# EAGLE design welder_pcb (EAGLE 8.5.2)
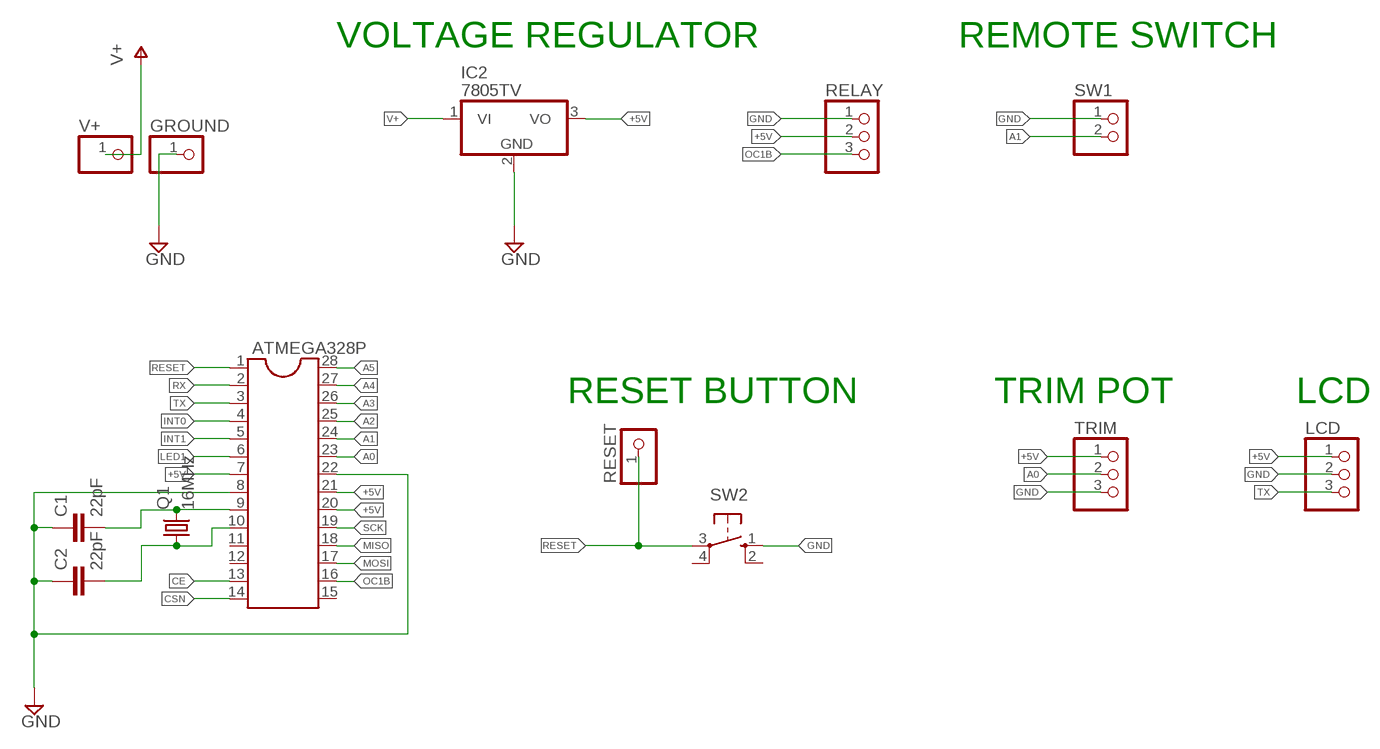
[diagram p0: schematic, sheet 1]

## Parts
ATMEGA328P  DIL28-3  [DIL28-3]
C1  22pF  C2,5-3  [C2.5-3]
C2  22pF  C2,5-3  [C2.5-3]
GROUND  PINHD-1X1  [1X01]
IC2  7805TV  [TO220V]
LCD  PINHD-1X3  [1X03]
Q1  16MHz  CRYSTALHC49U-V  [HC49U-V]
RELAY  PINHD-1X3  [1X03]
RESET  PINHD-1X1  [1X01]
SW1  PINHD-1X2  [1X02]
SW2  10-XX  [B3F-10XX]
TRIM  PINHD-1X3  [1X03]
V+  PINHD-1X1  [1X01]

## Nets
+5V: ATMEGA328P.7 ATMEGA328P.20 ATMEGA328P.21 IC2.3(VO) LCD.1 RELAY.2 TRIM.1
A0: ATMEGA328P.23 TRIM.2
A1: ATMEGA328P.24 SW1.2
A2: ATMEGA328P.25
A3: ATMEGA328P.26
A4: ATMEGA328P.27
A5: ATMEGA328P.28
CE: ATMEGA328P.13
CSN: ATMEGA328P.14
GND: ATMEGA328P.8 ATMEGA328P.22 C1.1 C2.1 GROUND.1 IC2.2(GND) LCD.2 RELAY.1 SW1.1 SW2.1(S) TRIM.3
INT0: ATMEGA328P.4
INT1: ATMEGA328P.5
LED1: ATMEGA328P.6
MISO: ATMEGA328P.18
MOSI: ATMEGA328P.17
N$1: ATMEGA328P.9 C1.2 Q1.2
N$2: ATMEGA328P.10 C2.2 Q1.1
OC1B: ATMEGA328P.16 RELAY.3
RESET: ATMEGA328P.1 RESET.1 SW2.3(P)
RX: ATMEGA328P.2
SCK: ATMEGA328P.19
TX: ATMEGA328P.3 LCD.3
V+: IC2.1(VI) V+.1
Unconnected: ATMEGA328P.11 ATMEGA328P.12 ATMEGA328P.15 SW2.2(S1) SW2.4(P1)

## Notes on the sheet
- VOLTAGE REGULATOR | REMOTE SWITCH
- RESET BUTTON | TRIM POT | LCD

## Library data of the parts
ATMEGA328P = ic-package:DIL28: Dual In Line
C1 C2 = capacitor-wima:C: CAPACITOR naming: grid - package width
GROUND RESET V+ = pinhead:PINHD-1X1: PIN HEADER
IC2 = linear:78*: Positive VOLTAGE REGULATOR Source: http://cache.national.com/ds/LM/LM78L05.pdf http://www.fairchildsemi.com/ds/LM/LM7805.pdf
LCD RELAY TRIM = pinhead:PINHD-1X3: PIN HEADER
Q1 = crystal:CRYSTAL: CRYSTAL; OC_FARNELL: 1666969; OC_NEWARK: unknown
SW1 = pinhead:PINHD-1X2: PIN HEADER
SW2 = switch-omron:10-XX: OMRON SWITCH; MPN: B3F-1000; OC_FARNELL: 176432; OC_NEWARK: 36M3542

## Board
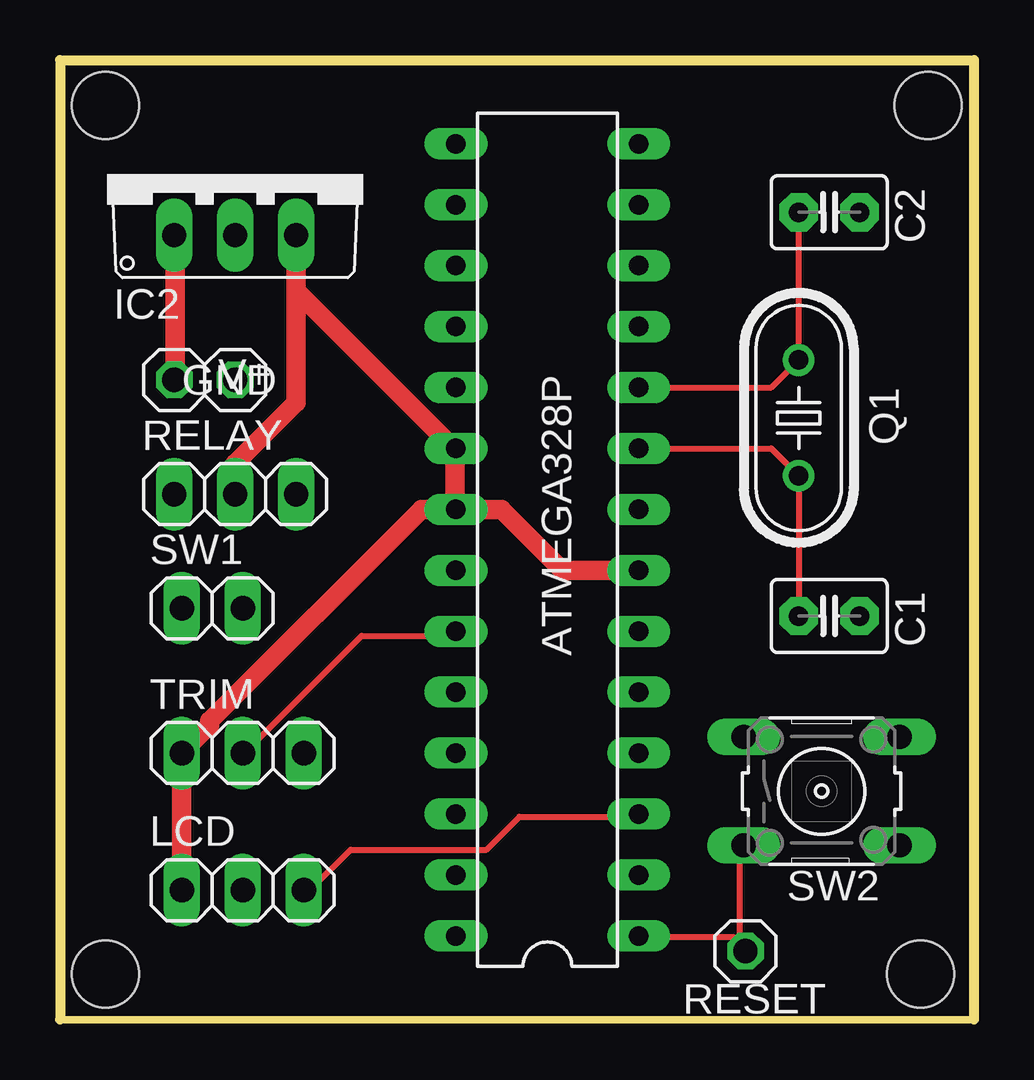
[diagram p1: board, top side]
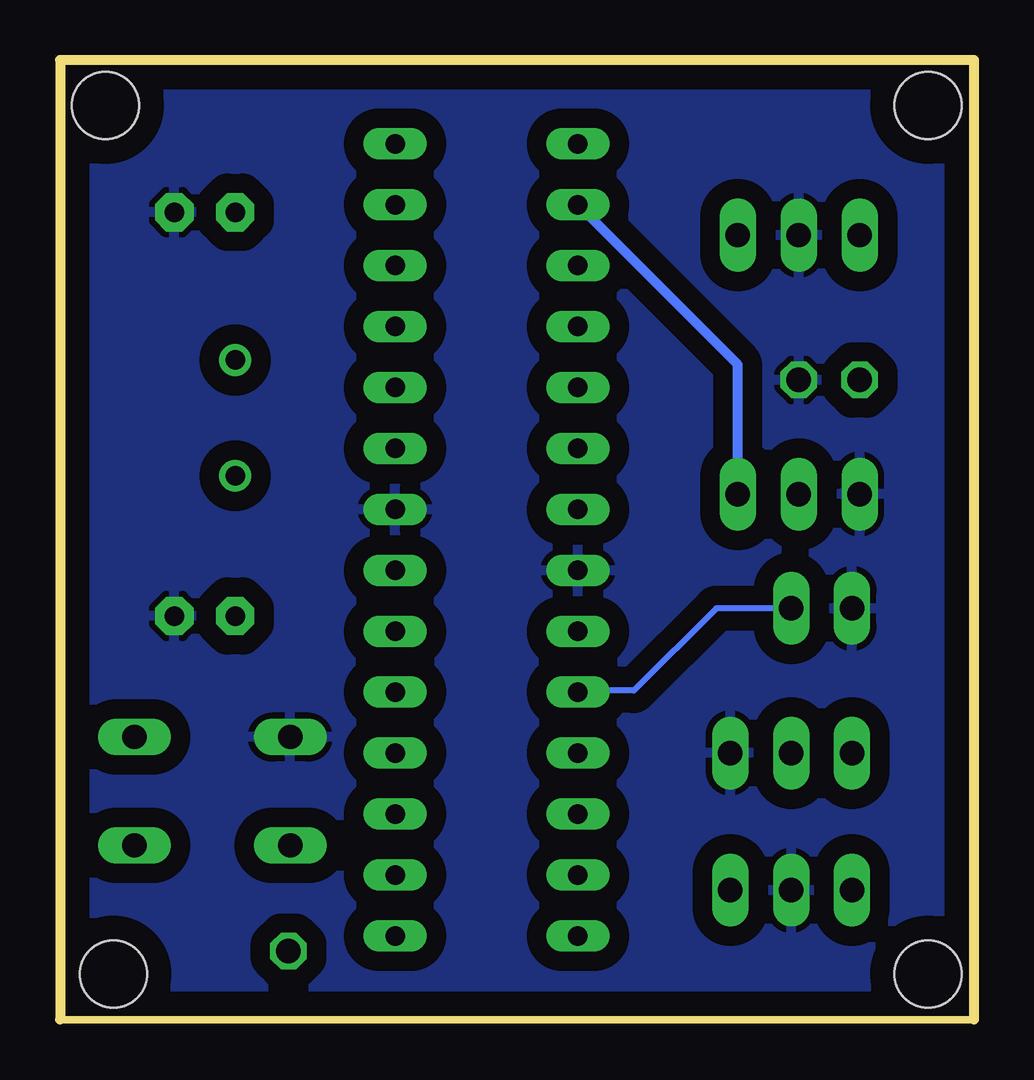
[diagram p2: board, bottom side, seen from below]

Size 38.1 x 40.01 mm. Coordinates in mm from the lower left corner, seen from the top.
Outline: 0,0 38.1,0 38.1,40.01 0,40.01 0,0
Copper layers (1*16): Top 0.035mm / dielectric 1.5mm / Bottom 0.035mm
Design rules "default": minimum track width 10mil, minimum drill 24mil, track to track 8mil, track to pad 8mil, pad to pad 8mil, via to via 8mil, smd to smd 8mil, copper to edge 40mil, drill to drill 8mil, minimum pad ring 10mil, minimum via ring 8mil, stop-mask expansion 4mil, vias tented up to drill 0mil, thermal gap 10mil
Holes 2.79 mm at 1.91,38.1 36.2,38.1 35.88,1.91 1.91,1.91

### Footprints (pad centres in the part's own frame; a part is rotated, then mirrored left to right if it is on the bottom)
DIL28-3 = drill 0.813 long: 1 -16.51,-3.81; 2 -13.97,-3.81; 3 -11.43,-3.81; 4 -8.89,-3.81; 5 -6.35,-3.81; 6 -3.81,-3.81; 7 -1.27,-3.81; 8 1.27,-3.81; 9 3.81,-3.81; 10 6.35,-3.81; 11 8.89,-3.81; 12 11.43,-3.81; 13 13.97,-3.81; 14 16.51,-3.81; 15 16.51,3.81; 16 13.97,3.81; 17 11.43,3.81; 18 8.89,3.81; 19 6.35,3.81; 20 3.81,3.81; 21 1.27,3.81; 22 -1.27,3.81; 23 -3.81,3.81; 24 -6.35,3.81; 25 -8.89,3.81; 26 -11.43,3.81; 27 -13.97,3.81; 28 -16.51,3.81
C2.5-3 = drill 0.813 pad 1.6 octagon: 1 -1.27,0; 2 1.27,0
1X01 = drill 1.016 octagon: 1 0,0
TO220V = drill 1.016 long: 1 -2.54,-2.54; 2 0,-2.54; 3 2.54,-2.54
1X03 = drill 1.016 long: 1 -2.54,0; 2 0,0; 3 2.54,0
HC49U-V = drill 0.813: 1 -2.413,0; 2 2.413,0
1X02 = drill 1.016 long: 1 -1.27,0; 2 1.27,0
B3F-10XX = drill 1.016 long: 1 -3.251,2.261; 2 3.251,2.261; 3 -3.251,-2.261; 4 3.251,-2.261

### Placement (x,y rotation side)
ATMEGA328P  20.32,20 90 top
C1  32.07,16.83 180 top
C2  32.07,33.66 180 top
GROUND  7.3,26.67 90 top
IC2  7.3,35.24 0 top
LCD  7.62,5.4 0 top
Q1  30.8,25.08 270 top
RELAY  7.3,21.91 0 top
RESET  28.57,2.86 0 top
SW1  6.35,17.14 0 top
SW2  31.75,9.53 0 top
TRIM  7.62,11.11 0 top
V+  4.76,26.67 90 top

### Tracks (layer width: path | path; a pad name or v marks a point on that pad's centre or on a via)
+5V
  Top 0.254: 16.46,21.49 ATMEGA328P.21 | 16.46,23.77 ATMEGA328P.20
  Top 0.813: IC2.3 9.84,30.39 | 9.84,30.39 16.46,23.77 | LCD.1 TRIM.1 6.25,12.28 6.25,12.44 15.08,21.27 ATMEGA328P.21 18.41,21.27 20.95,18.73 ATMEGA328P.7 | ATMEGA328P.20 16.46,23.76 16.46,21.49 | RELAY.2 7.3,23.18 9.84,25.72 9.84,30.39
A0
  Top 0.254: ATMEGA328P.23 16.46,16 12.57,16 7.77,11.2 TRIM.2
A1
  Bottom 0.254: ATMEGA328P.24 16.46,13.72 14.17,13.72 10.74,17.14 SW1.2
GND
  pour Bottom (isolate 0.813): 0,40.01 38.1,40.01 38.1,0 0,0
N$1
  Top 0.254: ATMEGA328P.9 29.65,23.81 Q1.2 C1.2
N$2
  Top 0.254: ATMEGA328P.10 29.65,26.35 Q1.1 C2.2
OC1B
  Bottom 0.406: RELAY.3 9.84,27.3 ATMEGA328P.16
RESET
  Top 0.254: 28.35,3.2 28.57,2.97 RESET.1 28.35,3.2 | 28.35,3.2 28.12,3.43 24.23,3.43 ATMEGA328P.1 | 28.35,3.2 28.35,7.09 SW2.3
TX
  Top 0.254: ATMEGA328P.3 24,8.46 19.15,8.46 17.78,7.09 12.12,7.09 10.52,5.49 LCD.3
V+
  Top 0.254: 4.8,26.75 V+.1 | 4.8,32.69 IC2.1
  Top 0.813: 4.8,32.69 4.8,26.75 4.8,32.69

### Text on the board
tNames: GND